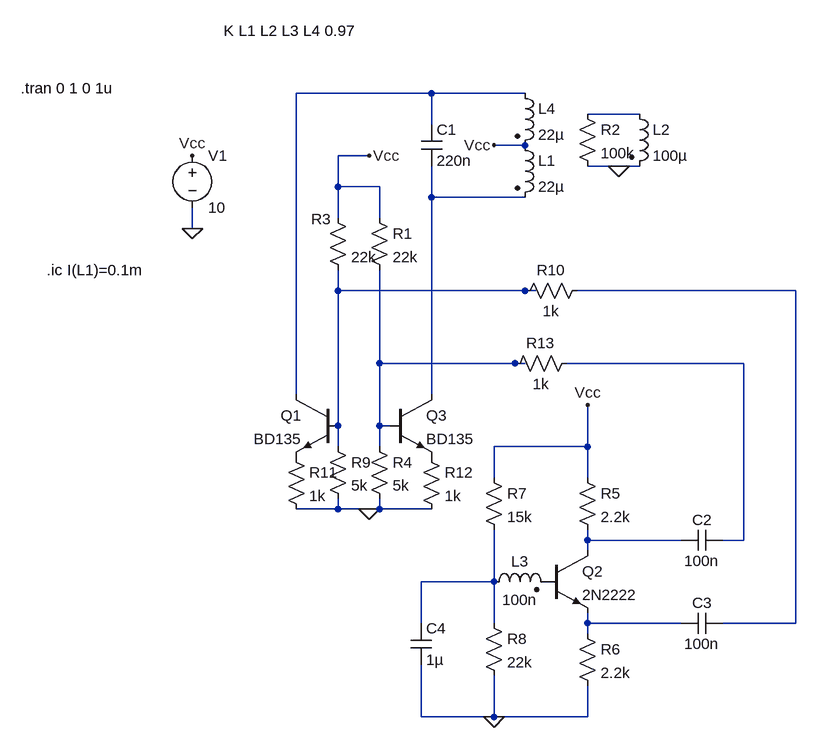
[diagram p0: schematic royer2.asc]
royer2.asc, the LTspice schematic file:
Version 4
SHEET 1 896 996
WIRE 240 16 32 16
WIRE 384 16 240 16
WIRE 560 48 480 48
WIRE 240 64 240 16
WIRE 384 96 336 96
WIRE 144 112 96 112
WIRE 528 128 480 128
WIRE 560 128 528 128
WIRE 96 160 96 112
WIRE 160 160 96 160
WIRE 240 176 240 128
WIRE 384 176 240 176
WIRE 96 208 96 160
WIRE 160 208 160 160
WIRE -128 224 -128 192
WIRE 96 320 96 288
WIRE 384 320 96 320
WIRE 400 320 384 320
WIRE 800 320 464 320
WIRE 160 432 160 288
WIRE 368 432 160 432
WIRE 384 432 368 432
WIRE 720 432 448 432
WIRE 32 480 32 16
WIRE 240 480 240 176
WIRE 96 528 96 320
WIRE 160 528 160 432
WIRE 176 528 160 528
WIRE 96 560 96 528
WIRE 160 560 160 528
WIRE 480 560 480 496
WIRE 480 560 336 560
WIRE 336 608 336 560
WIRE 480 608 480 560
WIRE 96 656 96 640
WIRE 96 656 32 656
WIRE 144 656 96 656
WIRE 160 656 160 640
WIRE 160 656 144 656
WIRE 240 656 160 656
WIRE 480 704 480 688
WIRE 624 704 480 704
WIRE 720 704 720 432
WIRE 720 704 688 704
WIRE 480 720 480 704
WIRE 336 768 336 688
WIRE 336 768 224 768
WIRE 224 832 224 768
WIRE 336 832 336 768
WIRE 480 832 480 816
WIRE 624 832 480 832
WIRE 800 832 800 320
WIRE 800 832 688 832
WIRE 480 848 480 832
WIRE 224 976 224 896
WIRE 336 976 336 912
WIRE 336 976 224 976
WIRE 480 976 480 928
WIRE 480 976 336 976
FLAG -128 224 0
FLAG -128 112 Vcc
FLAG 336 96 Vcc
FLAG 144 112 Vcc
FLAG 528 128 0
FLAG 336 976 0
FLAG 480 496 Vcc
FLAG 144 656 0
SYMBOL voltage -128 96 R0
WINDOW 123 0 0 Left 0
WINDOW 39 0 0 Left 0
SYMATTR InstName V1
SYMATTR Value 10
SYMBOL ind2 368 80 R0
SYMATTR InstName L1
SYMATTR Value 22µ
SYMATTR Type ind
SYMBOL ind2 544 32 R0
SYMATTR InstName L2
SYMATTR Value 100µ
SYMATTR Type ind
SYMBOL ind2 320 784 R270
WINDOW 0 32 56 VTop 2
WINDOW 3 4 56 VBottom 2
SYMATTR InstName L3
SYMATTR Value 100n
SYMATTR Type ind
SYMATTR SpiceLine Rser=0.1
SYMBOL npn 96 480 M0
SYMATTR InstName Q1
SYMATTR Value BD135
SYMBOL ind2 368 0 R0
SYMATTR InstName L4
SYMATTR Value 22µ
SYMATTR Type ind
SYMBOL cap 224 64 R0
SYMATTR InstName C1
SYMATTR Value 220n
SYMBOL res 144 192 R0
SYMATTR InstName R1
SYMATTR Value 22k
SYMBOL res 464 32 R0
SYMATTR InstName R2
SYMATTR Value 100k
SYMBOL npn 176 480 R0
SYMATTR InstName Q3
SYMATTR Value BD135
SYMBOL npn 416 720 R0
SYMATTR InstName Q2
SYMATTR Value 2N2222
SYMBOL res 464 592 R0
SYMATTR InstName R5
SYMATTR Value 2.2k
SYMBOL res 464 832 R0
SYMATTR InstName R6
SYMATTR Value 2.2k
SYMBOL res 320 592 R0
SYMATTR InstName R7
SYMATTR Value 15k
SYMBOL res 320 816 R0
SYMATTR InstName R8
SYMATTR Value 22k
SYMBOL cap 208 832 R0
SYMATTR InstName C4
SYMATTR Value 1µ
SYMBOL cap 688 688 R90
WINDOW 0 0 32 VBottom 2
WINDOW 3 32 32 VTop 2
SYMATTR InstName C2
SYMATTR Value 100n
SYMBOL cap 688 816 R90
WINDOW 0 0 32 VBottom 2
WINDOW 3 32 32 VTop 2
SYMATTR InstName C3
SYMATTR Value 100n
SYMBOL res 80 192 R0
WINDOW 0 -25 18 Left 2
SYMATTR InstName R3
SYMATTR Value 22k
SYMBOL res 16 560 R0
SYMATTR InstName R11
SYMATTR Value 1k
SYMBOL res 224 560 R0
SYMATTR InstName R12
SYMATTR Value 1k
SYMBOL res 144 544 R0
SYMATTR InstName R4
SYMATTR Value 5k
SYMBOL res 80 544 R0
SYMATTR InstName R9
SYMATTR Value 5k
SYMBOL res 480 304 R90
WINDOW 0 0 56 VBottom 2
WINDOW 3 32 56 VTop 2
SYMATTR InstName R10
SYMATTR Value 1k
SYMBOL res 352 448 R270
WINDOW 0 32 56 VTop 2
WINDOW 3 0 56 VBottom 2
SYMATTR InstName R13
SYMATTR Value 1k
TEXT -80 -80 Left 2 !K L1 L2 L3 L4 0.97
TEXT -392 8 Left 2 !.tran 0 1 0 1u
TEXT -352 288 Left 2 !.ic I(L1)=0.1m

The netlist it stands for:
* royer2.asc
V1 Vcc 0 10
L1 Vcc N003 22µ
L2 N002 0 100µ
L3 N009 P001 100n Rser=0.1
Q1 N001 N004 P002 0 BD135
L4 N001 Vcc 22µ
C1 N001 N003 220n
R1 Vcc N006 22k
R2 N002 0 100k
Q3 N003 N006 P003 0 BD135
Q2 N008 P001 N010 0 2N2222
R5 Vcc N008 2.2k
R6 N010 0 2.2k
R7 Vcc N009 15k
R8 N009 0 22k
C4 N009 0 1µ
C2 N007 N008 100n
C3 N005 N010 100n
R3 Vcc N004 22k
R11 P002 0 1k
R12 P003 0 1k
R4 N006 0 5k
R9 N004 0 5k
R10 N005 N004 1k
R13 N006 N007 1k
.model NPN NPN
.model PNP PNP
.lib standard.bjt
K L1 L2 L3 L4 0.97
.tran 0 1 0 1u
.ic I(L1)=0.1m
.backanno
.end